# EAGLE schematic BaoFengTRRSAdapter (EAGLE 6.5.0)
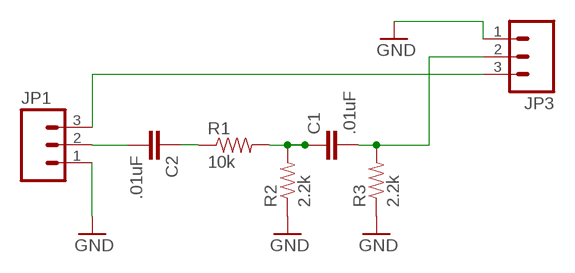
[diagram p0: schematic, sheet 1]

## Parts
C1  .01uF  CAP0603-CAP  [0603-CAP]
C2  .01uF  CAP0603-CAP  [0603-CAP]
JP1  M031X03_NO_SILK  [1X03_NO_SILK]
JP3  M031X03_NO_SILK  [1X03_NO_SILK]
R1  10k  RESISTOR0603-RES  [0603-RES]
R2  2.2k  RESISTOR0603-RES  [0603-RES]
R3  2.2k  RESISTOR0603-RES  [0603-RES]

## Nets
BAOFENGMIC+: JP1.3 JP3.3
GND: JP1.1 JP3.1 R2.1 R3.1
N$1: C2.2 JP1.2
N$3: C1.1 R1.2 R2.2
N$4: C1.2 JP3.2 R3.2
N$6: C2.1 R1.1

## Library data of the parts
C1 C2 = SparkFun-Passives:CAP: Capacitor Standard 0603 ceramic capacitor, and 0.1" leaded capacitor.
JP1 JP3 = SparkFun-Connectors:M03: Header 3 Standard 3-pin 0.1" header. Use with straight break away headers (SKU : PRT-00116), right angle break away headers (PRT-00553), swiss pins (PRT-00743), machine pins (PRT-00117), and female headers (PRT-00115). Molex polarized connector foot print use with SKU : PRT-08232 with associated crimp pins and housings.
R1-R3 = SparkFun-Passives:RESISTOR: Resistor Basic schematic elements and footprints for 0603, 1206, and PTH resistors.